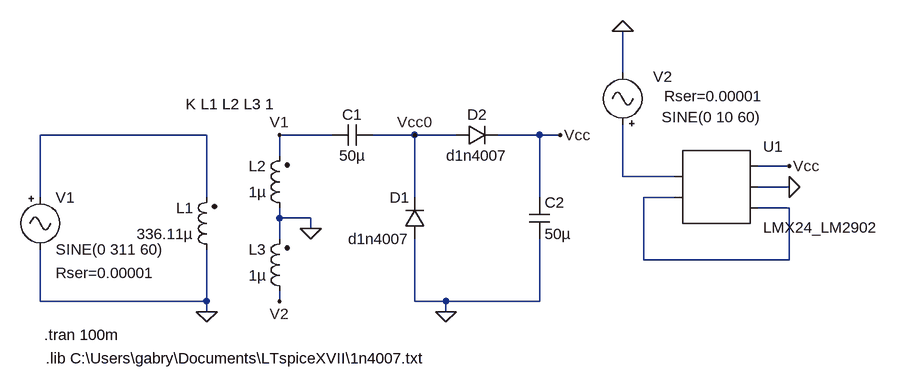
[diagram p0: schematic Draft2.asc]
Draft2.asc, the LTspice schematic file:
Version 4
SHEET 1 1288 680
WIRE 976 -112 976 -176
WIRE 336 -16 80 -16
WIRE 528 -16 448 -16
WIRE 656 -16 592 -16
WIRE 720 -16 656 -16
WIRE 848 -16 784 -16
WIRE 880 -16 848 -16
WIRE 448 16 448 -16
WIRE 1232 32 1184 32
WIRE 976 48 976 -32
WIRE 1056 48 976 48
WIRE 1232 64 1184 64
WIRE 80 80 80 -16
WIRE 336 80 336 -16
WIRE 656 80 656 -16
WIRE 848 80 848 -16
WIRE 1056 80 1008 80
WIRE 1232 96 1184 96
WIRE 448 112 448 96
WIRE 496 112 448 112
WIRE 496 128 496 112
WIRE 448 144 448 112
WIRE 1008 176 1008 80
WIRE 1232 176 1232 96
WIRE 1232 176 1008 176
WIRE 80 240 80 160
WIRE 336 240 336 160
WIRE 336 240 80 240
WIRE 448 240 448 224
WIRE 656 240 656 144
WIRE 704 240 656 240
WIRE 848 240 848 144
WIRE 848 240 704 240
WIRE 336 256 336 240
WIRE 704 256 704 240
FLAG 656 -16 Vcc0
FLAG 448 -16 V1
FLAG 336 256 0
FLAG 496 128 0
FLAG 704 256 0
FLAG 880 -16 Vcc
FLAG 1232 32 Vcc
FLAG 976 -176 0
FLAG 1232 64 0
FLAG 448 240 V2
SYMBOL Misc\\signal 80 64 R0
WINDOW 123 0 0 Left 0
WINDOW 39 24 132 Left 2
SYMATTR InstName V1
SYMATTR Value SINE(0 311 60)
SYMATTR SpiceLine Rser=0.00001
SYMBOL ind2 352 176 R180
WINDOW 0 36 80 Left 2
WINDOW 3 36 40 Left 2
SYMATTR InstName L1
SYMATTR Value 336.11µ
SYMATTR Type ind
SYMBOL ind2 464 112 R180
WINDOW 0 36 80 Left 2
WINDOW 3 36 40 Left 2
SYMATTR InstName L2
SYMATTR Value 1µ
SYMATTR Type ind
SYMBOL ind2 464 240 R180
WINDOW 0 36 80 Left 2
WINDOW 3 36 40 Left 2
SYMATTR InstName L3
SYMATTR Value 1µ
SYMATTR Type ind
SYMBOL cap 592 -32 R90
WINDOW 0 0 32 VBottom 2
WINDOW 3 32 32 VTop 2
SYMATTR InstName C1
SYMATTR Value 50µ
SYMBOL diode 672 144 R180
WINDOW 0 24 64 Left 2
WINDOW 3 24 0 Left 2
SYMATTR InstName D1
SYMATTR Value d1n4007
SYMBOL diode 720 0 R270
WINDOW 0 32 32 VTop 2
WINDOW 3 0 32 VBottom 2
SYMATTR InstName D2
SYMATTR Value d1n4007
SYMBOL cap 832 80 R0
SYMATTR InstName C2
SYMATTR Value 50µ
SYMBOL AutoGenerated\\LMX24_LM2902 1120 64 R0
SYMATTR InstName U1
SYMBOL Misc\\signal 976 -16 R180
WINDOW 0 -76 90 Left 2
WINDOW 3 -213 28 Left 2
WINDOW 123 0 0 Left 0
WINDOW 39 -217 60 Left 2
SYMATTR InstName V2
SYMATTR Value SINE(0 10 60)
SYMATTR SpiceLine Rser=0.00001
TEXT 304 -64 Left 2 !K L1 L2 L3 1
TEXT 88 328 Left 2 !.lib C:\\Users\\gabry\\Documents\\LTspiceXVII\\1n4007.txt
TEXT 86 292 Left 2 !.tran 100m

The netlist it stands for:
* Draft2.asc
V1 N001 0 SINE(0 311 60) Rser=0.00001
L1 0 N001 336.11µ
L2 0 V1 1µ
L3 V2 0 1µ
C1 Vcc0 V1 50µ
D1 0 Vcc0 d1n4007
D2 Vcc0 Vcc d1n4007
C2 Vcc 0 50µ
* U1: LMX24_LM2902 (symbol AutoGenerated\LMX24_LM2902 not available, pins judged from their places): pin1=N002 pin2=N003 pin3=Vcc pin4=0 pin5=N003
V2 N002 0 SINE(0 10 60) Rser=0.00001
.model D D
.lib standard.dio
K L1 L2 L3 1
.lib C:\Users\gabry\Documents\LTspiceXVII\1n4007.txt
.tran 100m
.backanno
.end